# EAGLE design touch_555_mini (EAGLE 6.5.0)
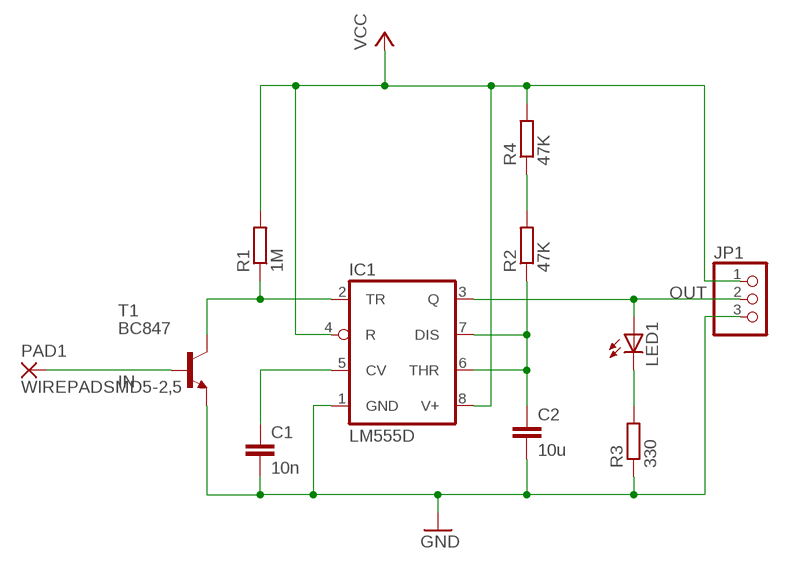
[diagram p0: schematic, sheet 1]

## Parts
C1  10n  C-EUC0805  [C0805]
C2  10u  C-EUC0805  [C0805]
IC1  LM555D  [SO08]
JP1  PINHD-1X3  [1X03]
LED1  LEDCHIPLED_1206  [CHIPLED_1206]
PAD1  WIREPADSMD5-2,5  [5-2,5]
R1  1M  R-EU_R0805  [R0805]
R2  47K  R-EU_R0805  [R0805]
R3  330  R-EU_R0805  [R0805]
R4  47K  R-EU_R0805  [R0805]
T1  BC847  [SOT23]

## Nets
GND: C1.2 C2.2 IC1.1(GND) JP1.3 R3.1 T1.2(E)
IN: PAD1.1(P) T1.1(B)
N$2: LED1.C R3.2
N$3: R2.2 R4.1
N$4: C1.1 IC1.5(CV)
N$5: IC1.2(TR) R1.1 T1.3(C)
N$6: C2.1 IC1.6(THR) IC1.7(DIS) R2.1
OUT: IC1.3(Q) JP1.2 LED1.A
VCC: IC1.4(R) IC1.8(V+) JP1.1 R1.2 R4.2

## Library data of the parts
C1 C2 = resistor:C-EU: CAPACITOR, European symbol
IC1 = linear:*555: TIMER
JP1 = pinhead:PINHD-1X3: PIN HEADER
LED1 = led:LED: LED OSRAM: - CHIPLED LG R971, LG N971, LY N971, LG Q971, LY Q971, LO R971, LY R971 LH N974, LH R974 LS Q976, LO Q976, LY Q976 LO Q996 - Hyper CHIPLED LW Q18S LB Q993, LB Q99A, LB R99A - SideLED LS A670, LO A670, LY A670, LG A670, LP A670 LB A673, LV A673, LT A673, LW A673 LH A674 LY A675 LS A676, LA A676, LO A676, LY A676, LW A676 LS A679, LY A679, LG A679 - Hyper Micro SIDELED® LS Y876, LA Y876, LO Y876, LY Y876 LT Y87S - SmartLED LW L88C, LW L88S LB L89C, LB L89S, LG L890 LS L89K, LO L89K, LY L89K LS L896, LA L896, LO L896, LY L896 - TOPLED LS T670, LO T670, LY T670, LG T670, LP T670 LSG T670, LSP T670, LSY T670, LOP T670, LYG T670 LG T671, LOG T671, LSG T671 LB T673, LV T673, LT T673, LW T673 LH T674 LS T676, LA T676, LO T676, LY T676, LB T676, LH T676, LSB T676, LW T676 LB T67C, LV T67C, LT T67C, LS T67K, LO T67K, LY T67K, LW E67C LS E67B, LA E67B, LO E67B, LY E67B, LB E67C, LV E67C, LT E67C LW T67C LS T679, LY T679, LG T679 LS T770, LO T770, LY T770, LG T770, LP T770 LB T773, LV T773, LT T773, LW T773 LH T774 LS E675, LA E675, LY E675, LS T675 LS T776, LA T776, LO T776, LY T776, LB T776 LHGB T686 LT T68C, LB T68C - Hyper Mini TOPLED® LB M676 - Mini TOPLED Santana® LG M470 LS M47K, LO M47K, LY M47K Source: http://www.osram.convergy.de LUXEON: - LUMILED® LXK2-PW12-R00, LXK2-PW12-S00, LXK2-PW14-U00, LXK2-PW14-V00 LXK2-PM12-R00, LXK2-PM12-S00, LXK2-PM14-U00 LXK2-PE12-Q00, LXK2-PE12-R00, LXK2-PE12-S00, LXK2-PE14-T00, LXK2-PE14-U00 LXK2-PB12-K00, LXK2-PB12-L00, LXK2-PB12-M00, LXK2-PB14-N00, LXK2-PB14-P00, LXK2-PB14-Q00 LXK2-PR12-L00, LXK2-PR12-M00, LXK2-PR14-Q00, LXK2-PR14-R00 LXK2-PD12-Q00, LXK2-PD12-R00, LXK2-PD12-S00 LXK2-PH12-R00, LXK2-PH12-S00 LXK2-PL12-P00, LXK2-PL12-Q00, LXK2-PL12-R00 Source: www.luxeon.com KINGBRIGHT: KA-3528ASYC Source: www.kingbright.com
PAD1 = wirepad:WIREPAD: Wire PAD connect wire on PCB
R1-R4 = resistor:R-EU_: RESISTOR, European symbol
T1 = transistor:BC847: NPN TRANSISTOR

## Board
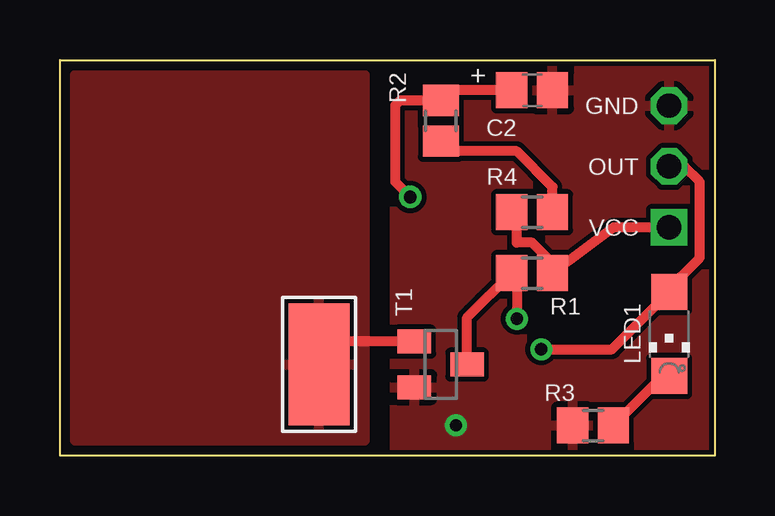
[diagram p1: board, top side]
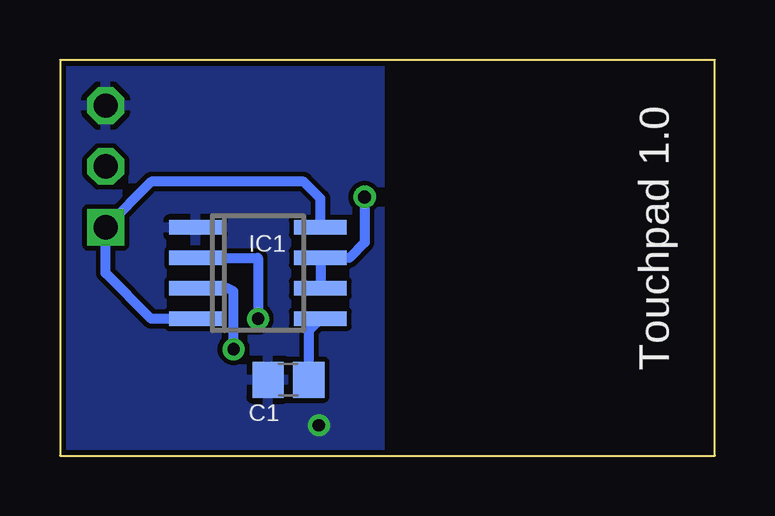
[diagram p2: board, bottom side, seen from below]

Size 27.3 x 16.51 mm. Coordinates in mm from the lower left corner, seen from the top.
Outline: 0,0 0,16.51 27.3,16.51 27.3,0 0,0
Copper layers (1*16): Top 0.035mm / dielectric 1.5mm / Bottom 0.035mm
Design rules "default *": minimum track width 10mil, minimum drill 20mil, track to track 8mil, track to pad 8mil, pad to pad 8mil, via to via 8mil, smd to smd 8mil, copper to edge 8mil, drill to drill 8mil, minimum pad ring 10mil, minimum via ring 8mil, stop-mask expansion 4mil, vias tented up to drill 0mil, thermal gap 10mil

### Footprints (pad centres in the part's own frame; a part is rotated, then mirrored left to right if it is on the bottom)
C0805 = smd 1.3 x 1.5: 1 -0.85,0; 2 0.85,0
SO08 = smd 0.6 x 2.2: 1 -1.905,-2.6; 2 -0.635,-2.6; 3 0.635,-2.6; 4 1.905,-2.6; 5 1.905,2.6; 6 0.635,2.6; 7 -0.635,2.6; 8 -1.905,2.6
1X03 = drill 1.016 square: 1 -2.54,0 | drill 1.016 octagon: 2 0,0; 3 2.54,0
CHIPLED_1206 = smd 1.5 x 1.5: A 0,-1.75; C 0,1.75
5-2,5 = smd 2.54 x 5.08: 1 0,0
R0805 = smd 1.3 x 1.5: 1 -0.85,0; 2 0.85,0
SOT23 = smd 1 x 1.4: 1 -0.95,-1.1; 2 0.95,-1.1; 3 0,1.1

### Placement (x,y rotation side)
C1  17.78,3.17 180 bottom
C2  19.69,15.24 0 top
IC1  19.05,7.62 270 bottom
JP1  25.4,12.07 90 top
LED1  25.4,5.08 180 top
PAD1  10.79,3.81 0 top
R1  19.69,7.62 0 top
R2  15.87,13.97 270 top
R3  22.23,1.27 0 top
R4  19.69,10.16 180 top
T1  15.87,3.81 270 top

### Tracks (layer width: path | path; a pad name or v marks a point on that pad's centre or on a via)
GND  (via drill 0.51)
  other vias: 16.51,1.27
  pour Top: 13.97,17.78 27.94,17.78 27.94,-0.64 13.97,-0.64
  pour Bottom: 13.97,17.78 27.94,17.78 27.94,-0.64 13.97,-0.64
IN
  Top 0.406: T1.1 11.74,4.76 PAD1.1
  pour Top: 0.63,15.88 12.7,15.88 12.7,0.63 0.63,0.63
N$2
  Top 0.406: LED1.C 25.4,3.59 R3.2
N$3
  Top 0.406: R4.1 20.54,11.21 19.05,12.7 16.3,12.7 R2.2
N$4
  Bottom 0.406: C1.1 16.93,5.23 IC1.5
N$5  (via drill 0.51)
  Top 0.406: T1.3 16.98,5.76 R1.1 19.05,7.62 v19.05,5.71
  Bottom 0.406: IC1.2 19.05,8.25 v19.05,5.71
N$6  (via drill 0.53)
  Top 0.406: C2.1 15.87,15.24 R2.1 14.19,14.82 13.97,14.61 13.97,11.43 v14.6,10.79
  Bottom 0.406: v14.6,10.79 14.6,8.89 15.24,8.25 IC1.7 IC1.6
OUT  (via drill 0.51)
  Top 0.406: JP1.2 26.04,12.07 26.67,11.43 26.67,8.25 25.88,7.46 LED1.A 23.02,4.45 v20.07,4.45
  Bottom 0.406: v20.07,4.45 20.07,6.86 20.32,6.98 IC1.3
VCC
  Top 0.406: JP1.1 23.08,9.53 R1.2 20.54,8.04 19.69,8.89 19.05,8.89 19.05,9.95 R4.2
  Bottom 0.406: IC1.4 23.5,5.71 25.4,7.62 JP1.1 23.5,11.43 17.14,11.43 16.45,10.73 IC1.8

### Text on the board
tNames: + | GND | OUT | VCC
bNames: Touchpad 1.0